# Altium schematic sheet MIPI-DSI DISPLAY.SchDoc
size A4; SheetNumber: 9; SheetTotal: 27
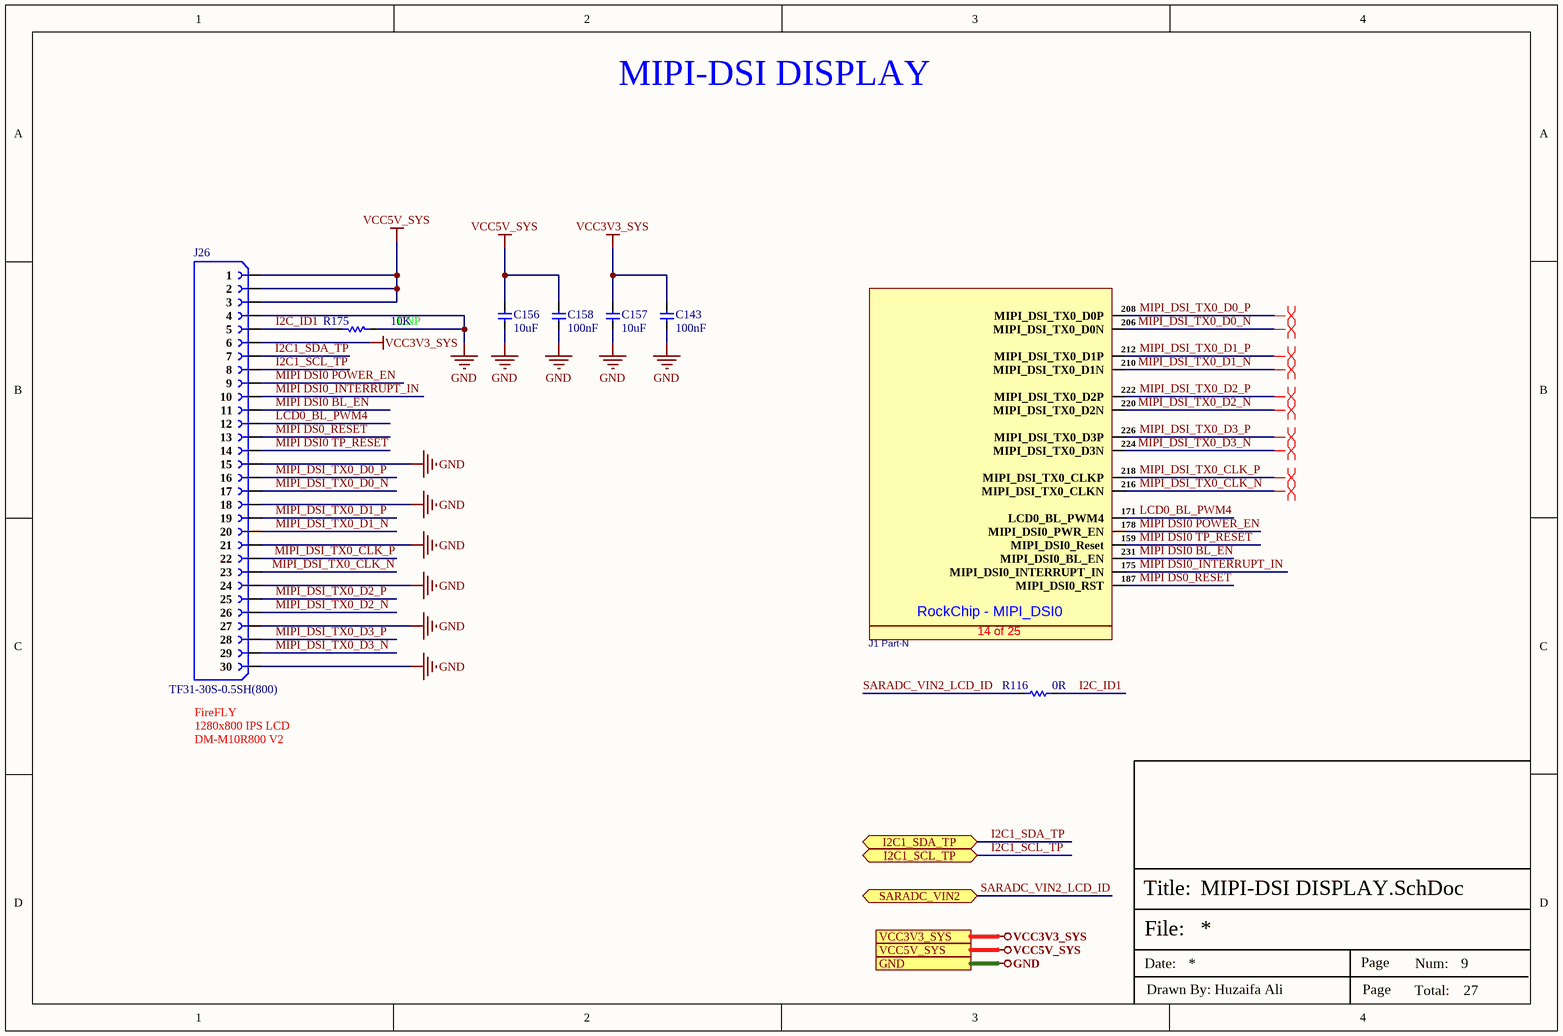
[diagram p0: MIPI-DSI DISPLAY.SchDoc]

## Parts
C143  100nF  [Cap-0402]
C156  10uF  [Cap-0603]
C157  10uF  [Cap-0603]
C158  100nF  [Cap-0402]
J1_Part-  AS0B826-S78B-7H  [AS0B826-S78B-7H]  (value not drawn)  (part N of 25)
J26  TF31-30S-0.5SH(800)  [TF31-30S-0.5SH(800)]
R116  0R  [Res-0402]
R175  DNP  [Res-0402]

## Ports
GND (see TOP SHEET[2B], AUDIO_INTERFACE[1D], BUCK REGULATOR[3D], DEBUG_UART_INTERFACE[3D], DIGITAL IO_RELAY_SHEET[5D], DUAL_SIM_INTERFACE[3D], ETHERNET_PHY0[4D], ETHERNET_PHY1[4D], GSM_INTERFACE[2D], HDMI_INTERFACE[3D], INPUT_PROTECTION[3D], LINEAR_VOLTAGE_REG[3D], MICRO_SD_INTERFACE[3D], POWER SECTION[3D], PUSH BUTTONs_INTERFACE[3C], RGB_LEDs_INTERFACE[3D], ROCKCHIP_PWR_SUPPLY[1D], ROCKCHIP_SYSTEM_CONTROL[3C], RS232_RS485_INTERFACE[3C], SENSOR_SHEET[3D], USB2.0_INTERFACE[3D], USB3.0_INTERFACE[3D], USB-C_INTERFACE[2D], WIEGAND_INTERFACE[3D], WIFI_BLUETOOTH_SHEET[4C]), I2C1_SCL_TP (bidir, see TOP SHEET[2B], DIGITAL IO_RELAY_SHEET[5D]), I2C1_SDA_TP (bidir, see TOP SHEET[2B], DIGITAL IO_RELAY_SHEET[5C]), SARADC_VIN2 (bidir, see TOP SHEET[2B], ROCKCHIP_GPIO_NC PINS[3C], ROCKCHIP_SYSTEM_CONTROL[3C]), VCC3V3_SYS (see TOP SHEET[2B], AUDIO_INTERFACE[1D], BUCK REGULATOR[3D], DEBUG_UART_INTERFACE[3D], DIGITAL IO_RELAY_SHEET[5D], ETHERNET_PHY0[4D], ETHERNET_PHY1[4D], GSM_INTERFACE[2D], HDMI_INTERFACE[3D], LINEAR_VOLTAGE_REG[3D], POWER SECTION[3D], PUSH BUTTONs_INTERFACE[3C], ROCKCHIP_PWR_SUPPLY[1D], ROCKCHIP_SYSTEM_CONTROL[3C], RS232_RS485_INTERFACE[3C], SENSOR_SHEET[3D], USB-C_INTERFACE[2D], WIEGAND_INTERFACE[3D], WIFI_BLUETOOTH_SHEET[4C]), VCC5V_SYS (see TOP SHEET[2B], BUCK REGULATOR[3D], DIGITAL IO_RELAY_SHEET[5D], HDMI_INTERFACE[3D], LINEAR_VOLTAGE_REG[3D], POWER SECTION[3D], RGB_LEDs_INTERFACE[3D], ROCKCHIP_PWR_SUPPLY[1D], USB2.0_INTERFACE[3D], USB3.0_INTERFACE[3D], USB-C_INTERFACE[2D], WIEGAND_INTERFACE[3D])

## Nets
GND: C143.1 C156.1 C157.1 C158.1 J26.4 J26.15 J26.18 J26.21 J26.24 J26.27 J26.30 R175.1 ; port GND
VCC3V3_SYS: C143.2 C157.2 J26.6 ; port VCC3V3_SYS
VCC5V_SYS: C156.2 C158.2 J26.1 J26.2 J26.3 ; port VCC5V_SYS
I2C1_SCL_TP: J26.8 ; port I2C1_SCL_TP
I2C1_SDA_TP: J26.7 ; port I2C1_SDA_TP
I2C_ID1: J26.5 R116.2 R175.2
LCD0_BL_PWM4: J1_Part-.171(LCD0_BL_PWM4) J26.12
MIPI DS0_RESET: J1_Part-.187(MIPI_DSI0_RST) J26.13
MIPI DSI0 BL_EN: J1_Part-.231(MIPI_DSI0_BL_EN) J26.11
MIPI DSI0 POWER_EN: J1_Part-.178(MIPI_DSI0_PWR_EN) J26.9
MIPI DSI0 TP_RESET: J1_Part-.159(MIPI_DSI0_Reset) J26.14
MIPI DSI0_INTERRUPT_IN: J1_Part-.175(MIPI_DSI0_INTERRUPT_IN) J26.10
MIPI_DSI_TX0_CLK_N: J1_Part-.216(MIPI_DSI_TX0_CLKN) J26.23
MIPI_DSI_TX0_CLK_P: J1_Part-.218(MIPI_DSI_TX0_CLKP) J26.22
MIPI_DSI_TX0_D0_N: J1_Part-.206(MIPI_DSI_TX0_D0N) J26.17
MIPI_DSI_TX0_D0_P: J1_Part-.208(MIPI_DSI_TX0_D0P) J26.16
MIPI_DSI_TX0_D1_N: J1_Part-.210(MIPI_DSI_TX0_D1N) J26.20
MIPI_DSI_TX0_D1_P: J1_Part-.212(MIPI_DSI_TX0_D1P) J26.19
MIPI_DSI_TX0_D2_N: J1_Part-.220(MIPI_DSI_TX0_D2N) J26.26
MIPI_DSI_TX0_D2_P: J1_Part-.222(MIPI_DSI_TX0_D2P) J26.25
MIPI_DSI_TX0_D3_N: J1_Part-.224(MIPI_DSI_TX0_D3N) J26.29
MIPI_DSI_TX0_D3_P: J1_Part-.226(MIPI_DSI_TX0_D3P) J26.28
SARADC_VIN2_LCD_ID: R116.1 ; port SARADC_VIN2

## Layout directives
differential pair; differential pair class DIFF-MIPI-100; rule Matched Net Lengths [Tolerance = 0.508mm]; rule Impedance Constraint [Min = 90.00    Max = 110.0    ]: MIPI_DSI_TX0_CLK_N, MIPI_DSI_TX0_CLK_P, MIPI_DSI_TX0_D0_N, MIPI_DSI_TX0_D0_P, MIPI_DSI_TX0_D1_N, MIPI_DSI_TX0_D1_P, MIPI_DSI_TX0_D2_N, MIPI_DSI_TX0_D2_P, MIPI_DSI_TX0_D3_N, MIPI_DSI_TX0_D3_P

## Notes on the sheet
- MIPI-DSI DISPLAY
- (near R175) 10K
- (near J26) FireFLY
- DM-M10R800 V2
- 1280x800 IPS LCD
- File:
- Title:
- Date:
- Page
- Num:
- Total:
- Drawn By: Huzaifa Ali
- (in symbol AS0B826-S78B-7H, part N) RockChip - MIPI_DSI0; 14 of 25

## Library data of the parts
C143 C158 = CC0402KRX5R7BB104: CAP CER 0.1UF 16V X5R 0402; Manufacturer: Yageo; Tolerance: 10%; Manufacturer Part Number: CC0402KRX5R7BB104; RoHS: Yes; Category: Ceramic Capacitors; Supplier 1: Mouser; Stock 1: 936792; Pricing 1: 1=0.10000, 10=0.02300, 50=0.02300, 100=0.01100, 1000=0.00600, 10000=0.00400 (USD); Mount: Surface Mount; Case/Package: 0402; Number of Pins: 2; Case Code (Metric): 1005; Case Code (Imperial): 0402; Min Operating Temperature: -55°C; Max Operating Temperature: 85°C; Capacitance: 100nF; Dielectric: X5R; Packaging: Tape and Reel; Voltage Rating: 16V; Package Quantity: 1; Voltage Rating (DC): 16V; Termination: SMD/SMT; Resistor Type: Ceramic; Series: CC; Construction: Flat; Length: 1mm; Width: 0.02inch; Height: 0.5mm; Thickness: 0.022inch; Depth: 0.5mm; Radiation Hardening: No; REACH SVHC: Unknown; Lead Free: Lead Free; Halogen Free: Halogen Free; RoHS Compliant: Yes; ComponentLink1URL: https://datasheet.ciiva.com/155/mlccorderingcode-155879.pdf?src-supplier=Digi-Key; ComponentLink1Description: https://datasheet.ciiva.com/155/mlccorderingcode-155879.pdf?src-supplier=Digi-Key; ComponentLink2URL: https://datasheet.ciiva.com/155/mlccorderingcode-155878.pdf?src-supplier=Digi-Key; ComponentLink2Description: https://datasheet.ciiva.com/155/mlccorderingcode-155878.pdf?src-supplier=Digi-Key; ComponentLink3URL: https://datasheet.ciiva.com/155/mlccorderingcode-155880.pdf?src-supplier=Digi-Key; ComponentLink3Description: https://datasheet.ciiva.com/155/mlccorderingcode-155880.pdf?src-supplier=Digi-Key; ComponentLink4URL: https://datasheet.ciiva.com/11464/upy-gphc-x5r-4v-to-50v-12-11464869.pdf?src-supplier=Avnet; ComponentLink4Description: https://datasheet.ciiva.com/11464/upy-gphc-x5r-4v-to-50v-12-11464869.pdf?src-supplier=Avnet; Supplier Part Number 1: 603-CC402KRX5R7BB104; LCSC Part Number: C106204
C156 C157 = C1608X5R1E106M080AC: CAP CER 10UF 25V X5R 0603; Manufacturer: TDK; Dielectric Material: Ceramic; Tolerance: 20%; Item Type: Capacitor; Supplier 1: Digi-Key; Manufacturer Part Number: C1608X5R1E106M080AC; Stock 1: 61681; Pricing 1: 1=0.96, 10=0.704, 100=0.483, 500=0.38238, 1000=0.322 (USD); Mount: Surface Mount; Case/Package: 0603; Weight: 7.1E-05oz; Case Code (Imperial): 0603; Case Code (Metric): 1608; Min Operating Temperature: -55°C; Max Operating Temperature: 85°C; Capacitance: 10uF; Packaging: Tape and Reel; Voltage Rating: 25V; Voltage Rating (DC): 25V; Termination: SMD/SMT; Package Quantity: 1; Dielectric: X5R; Composition: Ceramic; Length: 1.6mm; Height: 0.8mm; Width: 0.8mm; Thickness: 0.039inch; Depth: 0.8mm; Lead Free: Lead Free; REACH SVHC: No SVHC; Supplier Part Number 1: 445-9015-1-ND; LCSC Part Number: C2168289
J1_Part- = AS0B826-S78B-7H: SMD,P=0.5mm,Surface Mount，Right Angle; Manufacturer: FOXCONN; Item Type: Card Edge Connectors; Supplier: LCSC; Manufacturer Part Number: AS0B826-S78B-7H; RoHS: No; Stock: 4979; Pricing: 1=9.21, 10=8.287, 25=7.8064, 50=7.6064, 100=7.4062 (USD); LCSC Part Number: C426232
J26 = TF31-30S-0.5SH(800): CONN FFC BOTTOM 30POS 0.5MM R/A; Manufacturer: Hirose; Item Type: FFC / FPC Connector; Supplier: Digikey; Supplier Part Number: 26-TF31-30S-0.5SH(800)CT-ND; Manufacturer Part Number: TF31-30S-0.5SH(800); RoHS: Yes; Stock: 14095; Pricing: 1=2.37, 10=2.065, 25=1.9772, 50=1.9332, 100=1.8453, 250=1.66952, 500=1.53772, 1000=1.31805 (USD); ComponentLink1URL: https://www.hirose.com/product/download/?distributor=digikey&amp;type=specSheet&amp;lang=en&amp;num=TF31-30S-0.5SH(800)&src-supplier=Digikey; ComponentLink1Description: https://www.hirose.com/product/download/?distributor=digikey&amp;type=specSheet&amp;lang=en&amp;num=TF31-30S-0.5SH(800)&src-supplier=Digikey; ComponentLink2URL: https://datasheet.octopart.com/TF31-30S-0.5SH%28800%29-Hirose-datasheet-138123803.pdf?src-supplier=Sager+Electronics; ComponentLink2Description: https://datasheet.octopart.com/TF31-30S-0.5SH%28800%29-Hirose-datasheet-138123803.pdf?src-supplier=Sager+Electronics; LCSC Part Number: C5137133
R116 = RC0402FR-070RL: RES 0 OHM JUMPER 1/16W 0402; Manufacturer: Yageo; Power Rating: 62.5mW; Tolerance: 1%; Voltage Rating: 50V; Temperature Coefficient: 200ppm/°C; Max Power Dissipation: 63mW; Supplier 1: Mouser; Manufacturer Part Number: RC0402FR-070RL; RoHS: Yes; Category: Chip SMD Resistors; Stock 1: 8556842; Pricing 1: 1=0.10000, 10=0.01400, 50=0.01400, 100=0.00600, 1000=0.00300, 5000=0.00200, 10000=0.00100 (USD); Case/Package: 0402; Case Code (Imperial): 0402; Case Code (Metric): 1005; Size Code: 0402; Min Operating Temperature: -55°C; Max Operating Temperature: 155°C; Resistor Type: Thick Film; Resistance: 0R; Packaging: Tape and Reel; Termination: SMD/SMT; Features: Moisture Resistant; Series: RC; Number of Terminations: 2; Length: 1mm; Width: 0.5mm; Height: 0.35mm; RoHS Compliant: Yes; Lead Free: Lead Free; ComponentLink1URL: https://datasheet.ciiva.com/8896/pyu-rc0402-51-rohs-l-6-8896149.pdf?src-supplier=Avnet; ComponentLink1Description: https://datasheet.ciiva.com/8896/pyu-rc0402-51-rohs-l-6-8896149.pdf?src-supplier=Avnet; ComponentLink2URL: https://datasheet.ciiva.com/16790/pyu-rc0402-51-rohs-l-6-r-16790444.pdf?src-supplier=Future+Electronics; ComponentLink2Description: https://datasheet.ciiva.com/16790/pyu-rc0402-51-rohs-l-6-r-16790444.pdf?src-supplier=Future+Electronics; Supplier Part Number 1: 603-RC0402FR-070RL; LCSC Part Number: C106231; Mount: Surface Mount; Contact Plating: Tin,Matte; Radiation Hardening: No
R175 = RC0402FR-0710KL: RES 10K OHM 1% 1/16W 0402; Manufacturer: Yageo; Resistance: 10kR; Voltage Rating (DC): 50V; Temperature Coefficient: 100ppm/°C; Power Rating: 62.5mW; Max Power Dissipation: 63mW; Item Type: Resistor; Supplier 1: Mouser; Manufacturer Part Number: RC0402FR-0710KL; RoHS: Yes; Category: Chip SMD Resistors; Stock 1: 18648329; Pricing 1: 1=0.10000, 10=0.01400, 50=0.01400, 100=0.00500, 1000=0.00300, 10000=0.00200 (USD); Case/Package: 0402; Number of Pins: 2; Case Code (Imperial): 0402; Case Code (Metric): 1005; Min Operating Temperature: -55°C; Max Operating Temperature: 155°C; Resistor Type: Thick Film; Tolerance: 1%; Packaging: Tape and Reel; Voltage Rating: 50V; Termination: SMD/SMT; Working Voltage: 50V; Number of Terminations: 2; Features: Moisture Resistant; Series: RC; Resistance Tolerance: 1%; Construction: Rectangular; Length: 1mm; Width: 0.5mm; Height: 0.32mm; Depth: 0.5mm; Lead Pitch: 0.2mm; REACH SVHC: No SVHC; Lead Free: Lead Free; RoHS Compliant: Yes; Military Standard: Not; ComponentLink1URL: https://datasheet.ciiva.com/7660/38568-7660787.pdf?src-supplier=Element14; ComponentLink1Description: https://datasheet.ciiva.com/7660/38568-7660787.pdf?src-supplier=Element14; ComponentLink2URL: https://datasheet.ciiva.com/7849/1686128-7849814.pdf?src-supplier=Element14; ComponentLink2Description: https://datasheet.ciiva.com/7849/1686128-7849814.pdf?src-supplier=Element14; ComponentLink3URL: https://datasheet.ciiva.com/7983/1018594-7983486.pdf?src-supplier=Element14; ComponentLink3Description: https://datasheet.ciiva.com/7983/1018594-7983486.pdf?src-supplier=Element14; ComponentLink4URL: https://datasheet.ciiva.com/22747/1018594-22747512.pdf?src-supplier=Element14; ComponentLink4Description: https://datasheet.ciiva.com/22747/1018594-22747512.pdf?src-supplier=Element14; ComponentLink5URL: https://datasheet.ciiva.com/12667/pyu-rc0402-51-rohs-l-6-r-12667067.pdf?src-supplier=Mouser; ComponentLink5Description: https://datasheet.ciiva.com/12667/pyu-rc0402-51-rohs-l-6-r-12667067.pdf?src-supplier=Mouser; ComponentLink6URL: https://datasheet.ciiva.com/7849/1784430-7849813.pdf?src-supplier=Element14; ComponentLink6Description: https://datasheet.ciiva.com/7849/1784430-7849813.pdf?src-supplier=Element14; ComponentLink7URL: https://datasheet.ciiva.com/7849/1784430-7849815.pdf?src-supplier=Element14; ComponentLink7Description: https://datasheet.ciiva.com/7849/1784430-7849815.pdf?src-supplier=Element14; Supplier Part Number 1: 603-RC0402FR-0710KL; LCSC Part Number: C60490